# EAGLE design freesoc_mini_1.0 (EAGLE 6.3)
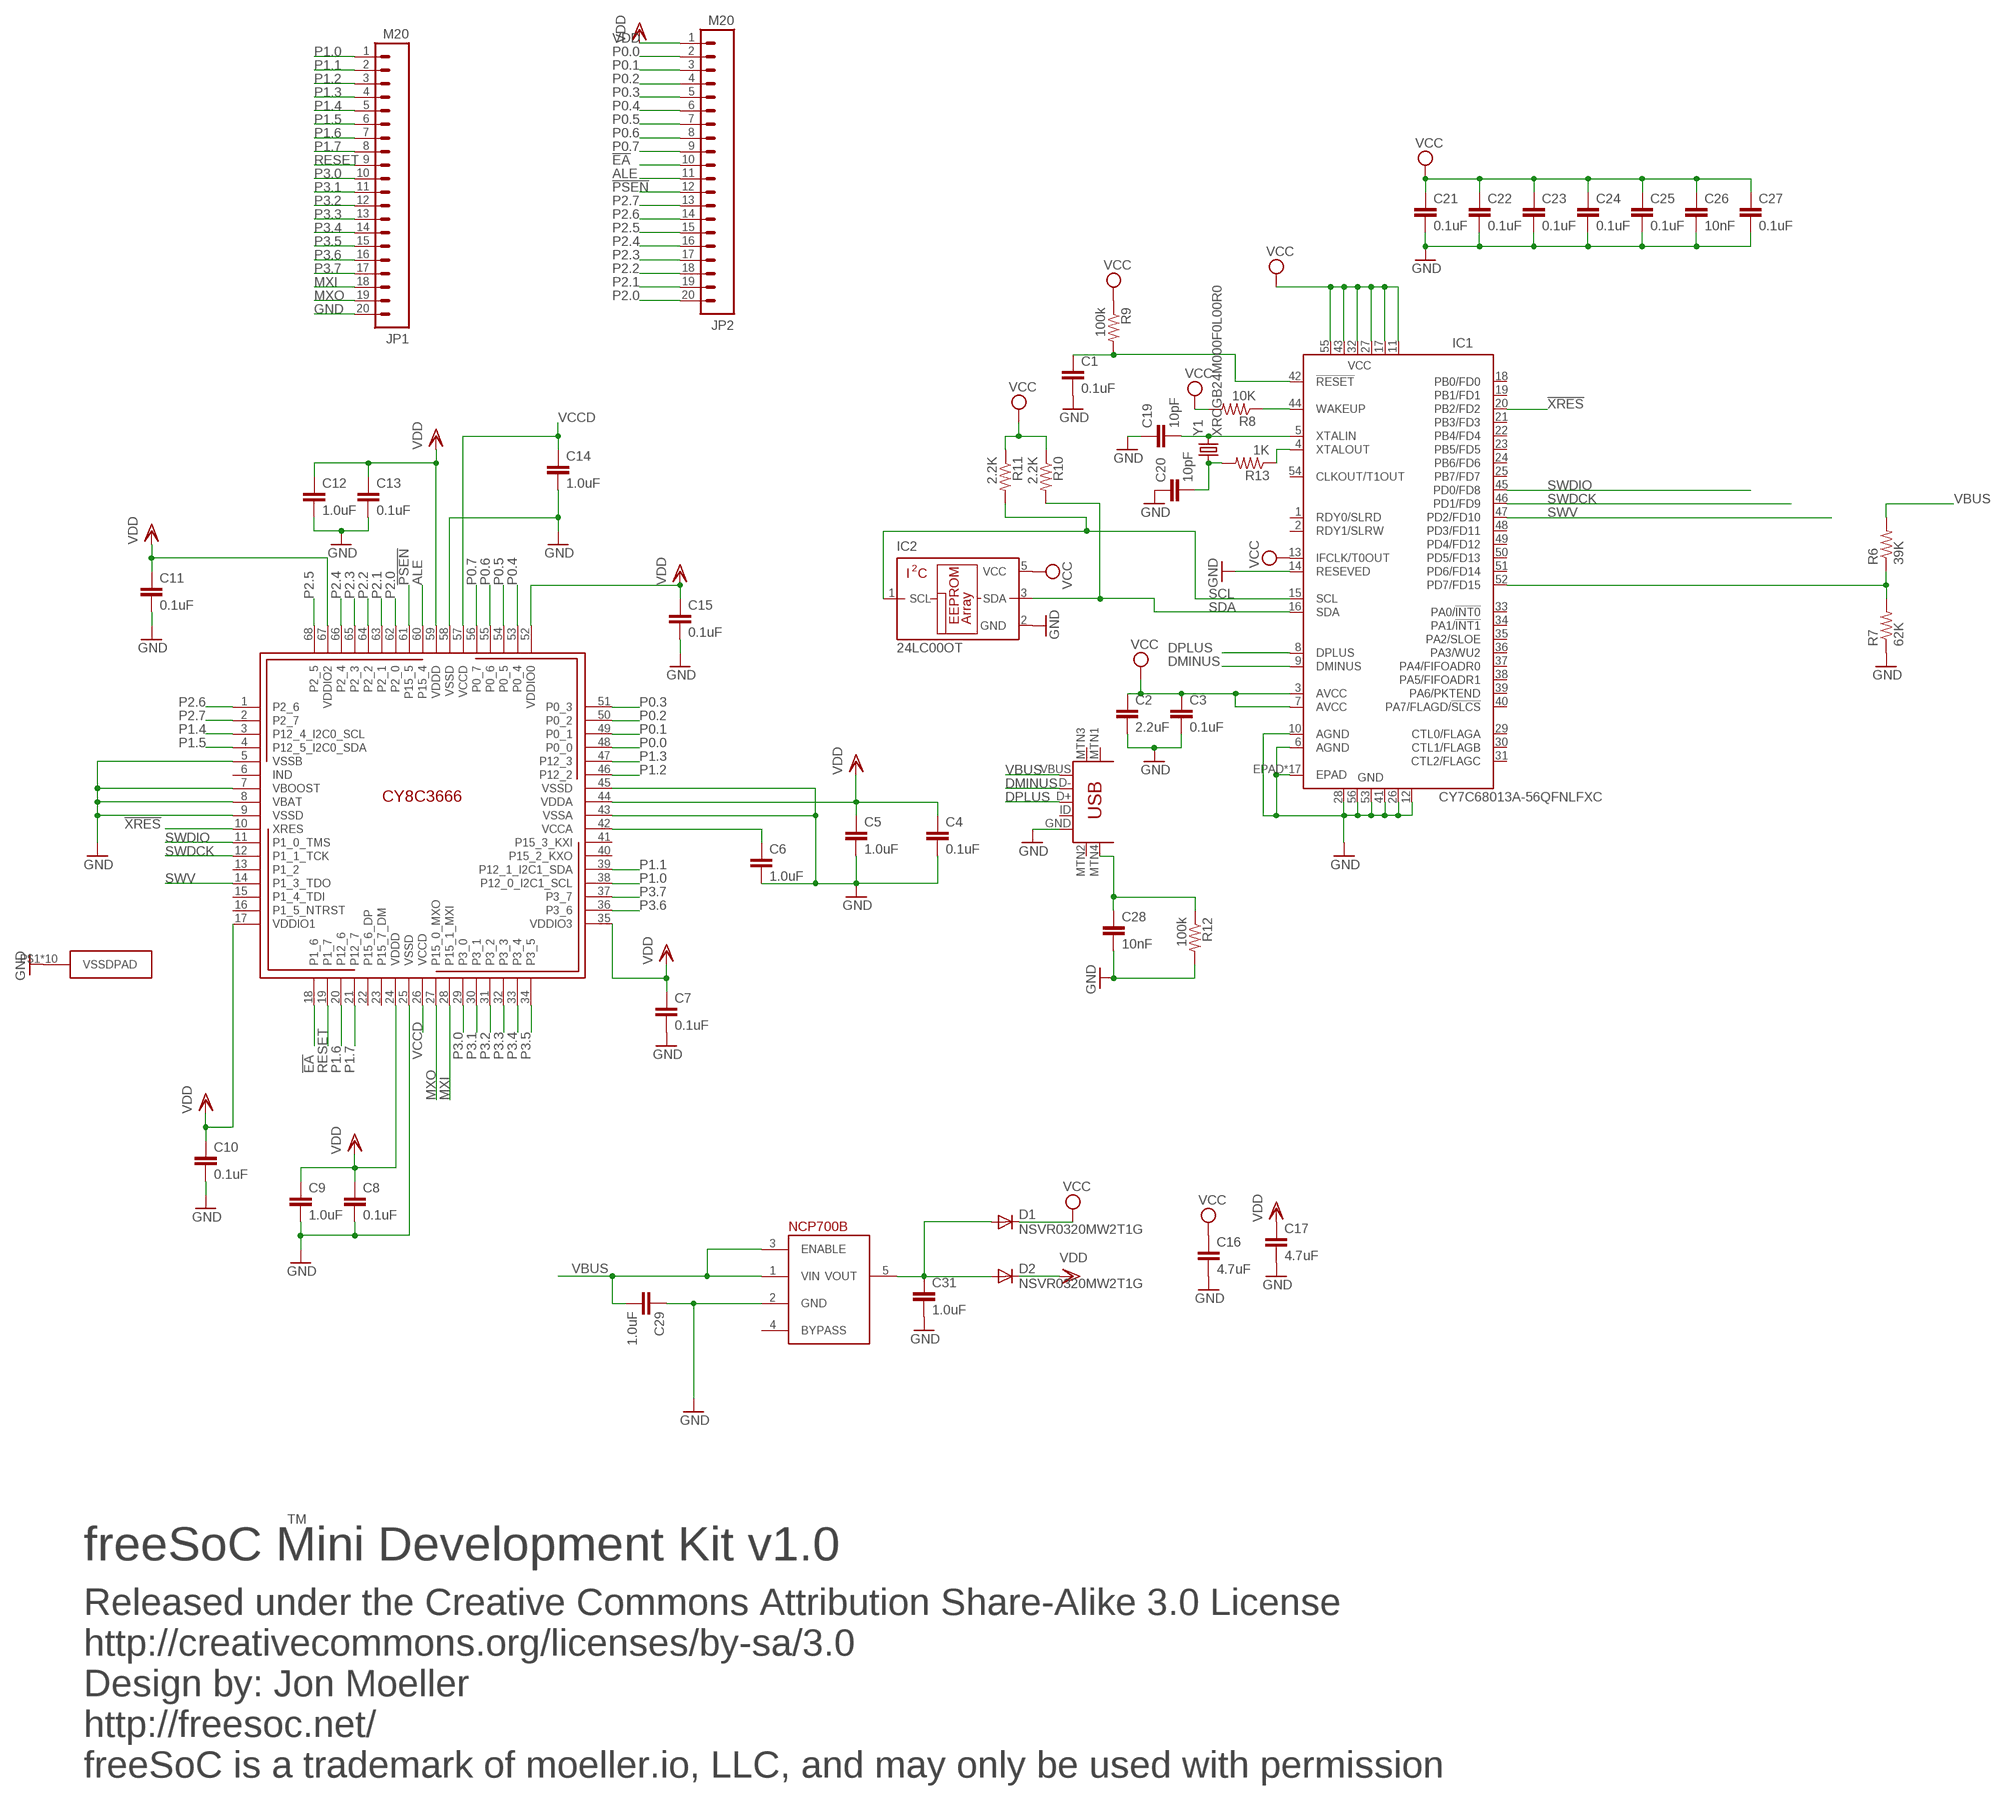
[diagram p0: schematic, sheet 1]

## Parts
C1  0.1uF  CAP0402-CAP  [0402-CAP]
C2  2.2uF  CAP0402-CAP  [0402-CAP]
C3  0.1uF  CAP0402-CAP  [0402-CAP]
C4  0.1uF  CAP0402-CAP  [0402-CAP]
C5  1.0uF  CAP0402-CAP  [0402-CAP]
C6  1.0uF  CAP0402-CAP  [0402-CAP]
C7  0.1uF  CAP0402-CAP  [0402-CAP]
C8  0.1uF  CAP0402-CAP  [0402-CAP]
C9  1.0uF  CAP0402-CAP  [0402-CAP]
C10  0.1uF  CAP0402-CAP  [0402-CAP]
C11  0.1uF  CAP0402-CAP  [0402-CAP]
C12  1.0uF  CAP0402-CAP  [0402-CAP]
C13  0.1uF  CAP0402-CAP  [0402-CAP]
C14  1.0uF  CAP0402-CAP  [0402-CAP]
C15  0.1uF  CAP0402-CAP  [0402-CAP]
C16  4.7uF  CAP0603-CAP  [0603-CAP]
C17  4.7uF  CAP0603-CAP  [0603-CAP]
C19  10pF  CAP0402-CAP  [0402-CAP]
C20  10pF  CAP0402-CAP  [0402-CAP]
C21  0.1uF  CAP0402-CAP  [0402-CAP]
C22  0.1uF  CAP0402-CAP  [0402-CAP]
C23  0.1uF  CAP0402-CAP  [0402-CAP]
C24  0.1uF  CAP0402-CAP  [0402-CAP]
C25  0.1uF  CAP0402-CAP  [0402-CAP]
C26  10nF  CAP0402-CAP  [0402-CAP]
C27  0.1uF  CAP0402-CAP  [0402-CAP]
C28  10nF  CAP0402-CAP  [0402-CAP]
C29  1.0uF  CAP0402-CAP  [0402-CAP]
C31  1.0uF  CAP0402-CAP  [0402-CAP]
D1  NSVR0320MW2T1G  DIODESOD  [SOD-323]
D2  NSVR0320MW2T1G  DIODESOD  [SOD-323]
IC1  CY7C68013A-56QFNLFXC  [QFN56]
IC2  24LC00OT  [SOT23-5L]
JP1  M20  [1X20]
JP2  M20  [1X20]
R6  39K  RESISTOR0402-RES  [0402-RES]
R7  62K  RESISTOR0402-RES  [0402-RES]
R8  10K  RESISTOR0402-RES  [0402-RES]
R9  100k  RESISTOR0402-RES  [0402-RES]
R10  2.2K  RESISTOR0402-RES  [0402-RES]
R11  2.2K  RESISTOR0402-RES  [0402-RES]
R12  100k  RESISTOR0402-RES  [0402-RES]
R13  1K  RESISTOR0402-RES  [0402-RES]
U$1  CY8C3X66LTI  [QFN-68]
U$3  FAN2558S36X  NCP700B  [TSOP-5]
USB-MINIB  USB-MINIB-5PIN  [USB-MINIB]
Y1  XRCGB24M000F0L00R0  CRYSTALXRCGB  [CRYSTAL_RESONATOR]

## Nets
!EA: JP2.10 U$1.18(P1_6)
!PSEN: JP2.12 U$1.61(P15_5)
!XRES: IC1.20(PB2/FD2) U$1.10(XRES)
ALE: JP2.11 U$1.60(P15_4)
DMINUS: IC1.9(DMINUS) USB-MINIB.D-
DPLUS: IC1.8(DPLUS) USB-MINIB.D+
GND: C1.2 C2.2 C3.2 C4.2 C5.2 C6.2 C7.2 C8.2 C9.2 C10.2 C11.2 C12.2 C13.2 C14.2 C15.2 C16.2 C17.2 C19.1 C20.1 C21.2 C22.2 C23.2 C24.2 C25.2 C26.2 C27.2 C28.2 C29.1 C31.2 IC1.6(AGND) IC1.10(AGND) IC1.12(GND) IC1.14(RESEVED) IC1.26(GND) IC1.28(GND) IC1.41(GND) IC1.53(GND) IC1.56(GND) IC1.EPAD IC1.P$1(EPAD) IC1.P$2(EPAD) IC1.P$3(EPAD) IC1.P$4(EPAD) IC1.P$5(EPAD) IC1.P$6(EPAD) IC1.P$7(EPAD) IC1.P$8(EPAD) IC1.P$9(EPAD) IC1.P$10(EPAD) IC1.P$11(EPAD) IC1.P$12(EPAD) IC1.P$13(EPAD) IC1.P$14(EPAD) IC1.P$15(EPAD) IC1.P$16(EPAD) IC2.2(GND) JP1.20 R7.1 R12.2 U$1.5(VSSB) U$1.7(VBOOST) U$1.8(VBAT) U$1.9(VSSD) U$1.25(VSSD) U$1.43(VSSA) U$1.45(VSSD) U$1.58(VSSD) U$1.P$1(VSSDPAD) U$1.P$2(VSSDPAD) U$1.P$3(VSSDPAD) U$1.P$4(VSSDPAD) U$1.P$5(VSSDPAD) U$1.P$6(VSSDPAD) U$1.P$7(VSSDPAD) U$1.P$8(VSSDPAD) U$1.P$9(VSSDPAD) U$1.PAD(VSSDPAD) U$3.2(GND) USB-MINIB.GND
MXI: JP1.18 U$1.28(P15_1_MXI)
MXO: JP1.19 U$1.27(P15_0_MXO)
N$1: IC1.52(PD7/FD15) R6.1 R7.2
N$2: IC1.44(WAKEUP) R8.1
N$3: C1.1 IC1.42(!RESET) R9.2
N$4: C28.1 R12.1 USB-MINIB.MTN4
N$5: IC1.4(XTALOUT) R13.1
N$7: C20.2 R13.2 Y1.P$1
N$8: C19.2 IC1.5(XTALIN) Y1.P$4
N$13: C6.1 U$1.42(VCCA)
P0.0: JP2.2 U$1.48(P0_0)
P0.1: JP2.3 U$1.49(P0_1)
P0.2: JP2.4 U$1.50(P0_2)
P0.3: JP2.5 U$1.51(P0_3)
P0.4: JP2.6 U$1.53(P0_4)
P0.5: JP2.7 U$1.54(P0_5)
P0.6: JP2.8 U$1.55(P0_6)
P0.7: JP2.9 U$1.56(P0_7)
P1.0: JP1.1 U$1.38(P12_0_I2C1_SCL)
P1.1: JP1.2 U$1.39(P12_1_I2C1_SDA)
P1.2: JP1.3 U$1.46(P12_2)
P1.3: JP1.4 U$1.47(P12_3)
P1.4: JP1.5 U$1.3(P12_4_I2C0_SCL)
P1.5: JP1.6 U$1.4(P12_5_I2C0_SDA)
P1.6: JP1.7 U$1.20(P12_6)
P1.7: JP1.8 U$1.21(P12_7)
P2.0: JP2.20 U$1.62(P2_0)
P2.1: JP2.19 U$1.63(P2_1)
P2.2: JP2.18 U$1.64(P2_2)
P2.3: JP2.17 U$1.65(P2_3)
P2.4: JP2.16 U$1.66(P2_4)
P2.5: JP2.15 U$1.68(P2_5)
P2.6: JP2.14 U$1.1(P2_6)
P2.7: JP2.13 U$1.2(P2_7)
P3.0: JP1.10 U$1.29(P3_0)
P3.1: JP1.11 U$1.30(P3_1)
P3.2: JP1.12 U$1.31(P3_2)
P3.3: JP1.13 U$1.32(P3_3)
P3.4: JP1.14 U$1.33(P3_4)
P3.5: JP1.15 U$1.34(P3_5)
P3.6: JP1.16 U$1.36(P3_6)
P3.7: JP1.17 U$1.37(P3_7)
RESET: JP1.9 U$1.19(P1_7)
SCL: IC1.15(SCL) IC2.1(SCL) R11.2
SDA: IC1.16(SDA) IC2.3(SDA) R10.2
SWDCK: IC1.46(PD1/FD9) U$1.12(P1_1_TCK)
SWDIO: IC1.45(PD0/FD8) U$1.11(P1_0_TMS)
SWV: IC1.47(PD2/FD10) U$1.14(P1_3_TDO)
VBUS: C29.2 R6.2 U$3.1(VIN) U$3.3(ENABLE) USB-MINIB.VBUS
VCC: C2.1 C3.1 C16.1 C21.1 C22.1 C23.1 C24.1 C25.1 C26.1 C27.1 D1.1(C) IC1.3(AVCC) IC1.7(AVCC) IC1.11(VCC) IC1.13(IFCLK/T0OUT) IC1.17(VCC) IC1.27(VCC) IC1.32(VCC) IC1.43(VCC) IC1.55(VCC) IC2.5(VCC) R8.2 R9.1 R10.1 R11.1
VCCD: C14.1 U$1.26(VCCD) U$1.57(VCCD)
VDD: C4.1 C5.1 C7.1 C8.1 C9.1 C10.1 C11.1 C12.1 C13.1 C15.1 C17.1 D2.1(C) JP2.1 U$1.17(VDDIO1) U$1.24(VDDD) U$1.35(VDDIO3) U$1.44(VDDA) U$1.52(VDDIO0) U$1.59(VDDD) U$1.67(VDDIO2)
VOUT: C31.1 D1.2(A) D2.2(A) U$3.5(VOUT)
Unconnected: IC1.1(RDY0/SLRD) IC1.2(RDY1/SLRW) IC1.18(PB0/FD0) IC1.19(PB1/FD1) IC1.21(PB3/FD3) IC1.22(PB4/FD4) IC1.23(PB5/FD5) IC1.24(PB6/FD6) IC1.25(PB7/FD7) IC1.29(CTL0/FLAGA) IC1.30(CTL1/FLAGB) IC1.31(CTL2/FLAGC) IC1.33(PA0/!INT0) IC1.34(PA1/!INT1) IC1.35(PA2/SLOE) IC1.36(PA3/WU2) IC1.37(PA4/FIFOADR0) IC1.38(PA5/FIFOADR1) IC1.39(PA6/PKTEND) IC1.40(PA7/FLAGD/!SLCS) IC1.48(PD3/FD11) IC1.49(PD4/FD12) IC1.50(PD5/FD13) IC1.51(PD6/FD14) IC1.54(CLKOUT/T1OUT) U$1.6(IND) U$1.13(P1_2) U$1.15(P1_4_TDI) U$1.16(P1_5_NTRST) U$1.22(P15_6_DP) U$1.23(P15_7_DM) U$1.40(P15_2_KXO) U$1.41(P15_3_KXI) U$3.4(BYPASS) USB-MINIB.ID USB-MINIB.MTN1(MTN2) USB-MINIB.MTN2(MTN3) USB-MINIB.MTN3(MTN1)

## Notes on the sheet
- TM
- freeSoC Mini Development Kit v1.0
- Released under the Creative Commons Attribution Share-Alike 3.0 License
- http://creativecommons.org/licenses/by-sa/3.0
- Design by: Jon Moeller
- http://freesoc.net/
- freeSoC is a trademark of moeller.io, LLC, and may only be used with permission

## Library data of the parts
C1 C3 C4 C7 C8 C10 C11 C13 C15 C21-C25 C27 = SparkFun:CAP: Capacitor Standard 0603 ceramic capacitor, and 0.1" leaded capacitor.; PN: LMK105BJ104KV-F
C2 = SparkFun:CAP: Capacitor Standard 0603 ceramic capacitor, and 0.1" leaded capacitor.; PN: JMK105BJ225MV-F
C5 C6 C9 C12 C14 C29 C31 = SparkFun:CAP: Capacitor Standard 0603 ceramic capacitor, and 0.1" leaded capacitor.; PN: JMK105BJ105KV-F
C16 C17 = SparkFun:CAP: Capacitor Standard 0603 ceramic capacitor, and 0.1" leaded capacitor.; PN: CC0603KRX5R6BB475
C19 C20 = SparkFun:CAP: Capacitor Standard 0603 ceramic capacitor, and 0.1" leaded capacitor.; PN: GJM1555C1H100FB01D
C26 C28 = SparkFun:CAP: Capacitor Standard 0603 ceramic capacitor, and 0.1" leaded capacitor.; PN: TMK105B7103KV-F
D1 D2 = SparkFun:DIODE: Diode These are standard reverse protection diodes and small signal diodes. SMA package can handle up to about 1A. SOD-323 can handle about 200mA. What the SOD-323 package when ordering, there are some mfgs out there that are 5-pin packages.; PN: NSVR0320MW2T1G
IC1 = cypress:CY7C6801*A-56QFN: EZ-USB FX2LP (TM) USB Microcontroller Source: http://www.cypress.com .. cy7c68013a_5.pdf; PN: CY7C68013A-56LTXC
IC2 = microchip:24*00: Serial EEPROM 128 bit, I2C (AA = 1.8 V/LC = 2.5 V/C = 5.0 V); PN: 24LC00T
JP1 JP2 = SparkFun:M20
R6 R7 = SparkFun:RESISTOR: Resistor Basic schematic elements and footprints for 0603, 1206, and PTH resistors.
R8 = SparkFun:RESISTOR: Resistor Basic schematic elements and footprints for 0603, 1206, and PTH resistors.; PN: ERJ-2GEJ103X
R9 R12 = SparkFun:RESISTOR: Resistor Basic schematic elements and footprints for 0603, 1206, and PTH resistors.; PN: RR0510P-104-D
R10 R11 = SparkFun:RESISTOR: Resistor Basic schematic elements and footprints for 0603, 1206, and PTH resistors.; PN: ERJ-2RKF2201X
R13 = SparkFun:RESISTOR: Resistor Basic schematic elements and footprints for 0603, 1206, and PTH resistors.; PN: ERJ-2RKF1001X
U$1 = PSoC3:CY8C3X66LTI; PN: CY8C5568LTI-114
U$3 = linear:NCP700B; PN: FAN2558S36X
USB-MINIB = SparkFun:USB-MINIB: Mini-USB "B" connector with 5th pin broken out. Created new symbol breaking out 5th "ID" pin in mini/micro USB connector spec. See: http://en.wikipedia.org/wiki/Mini_usb#Cables. Uses same footprint as 4-pin symbol. Also added pins to connect to mounting / shield pads if required (probably not generally needed as signals aren't shielded once they leave the connector).; PN: 10033526-N3212LF
Y1 = SparkFun:CRYSTAL: Crystals Various standard crystals. Proven footprints. Spark Fun Electronics SKU : COM-00534; PN: XRCGB24M000F0L00R0

## Board
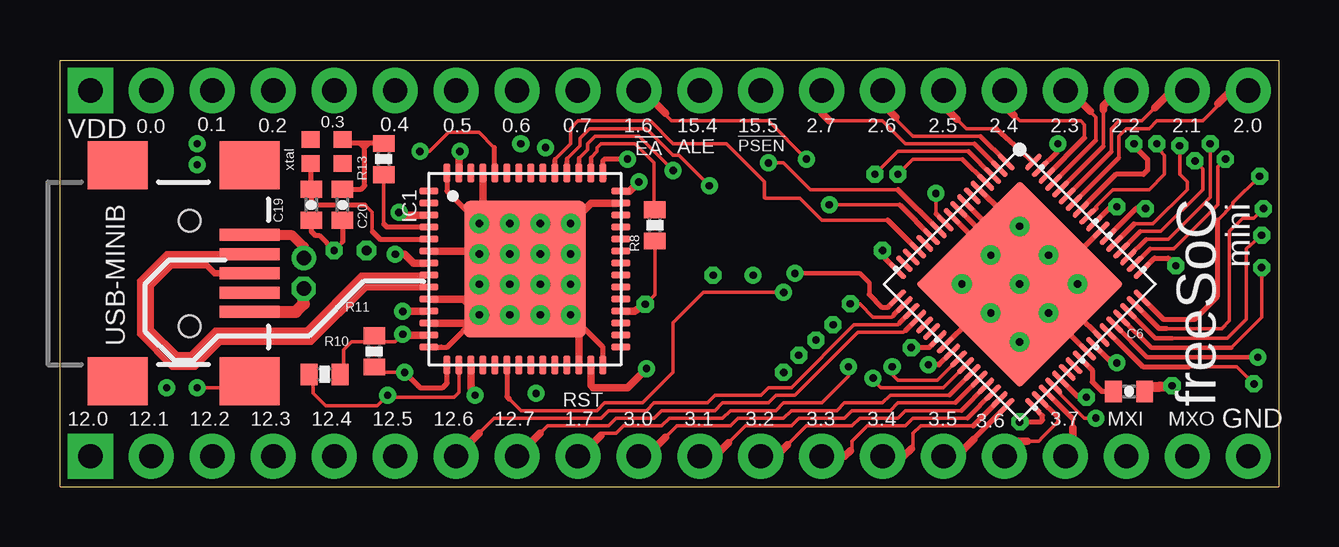
[diagram p1: board, top side]
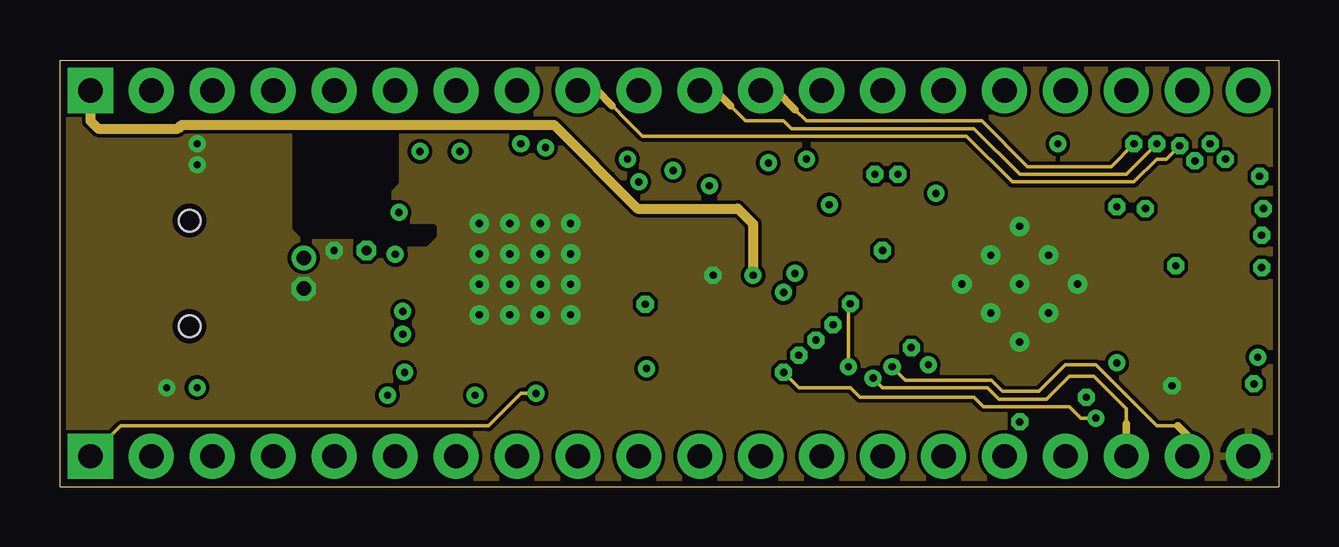
[diagram p2: board, inner layer Route2]
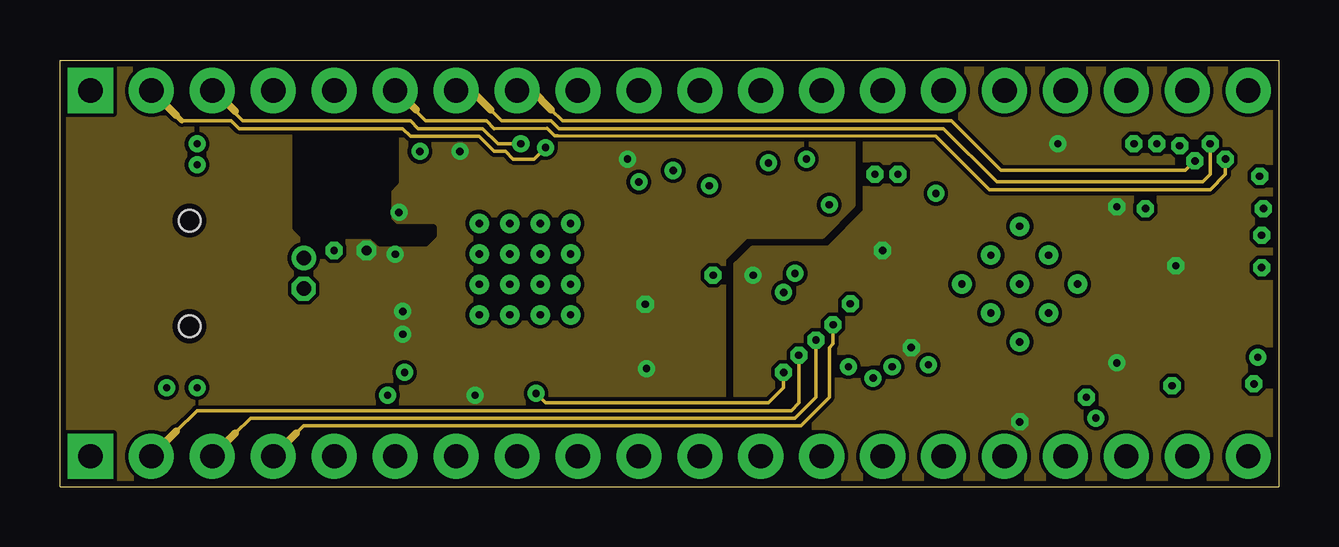
[diagram p3: board, inner layer Route15]
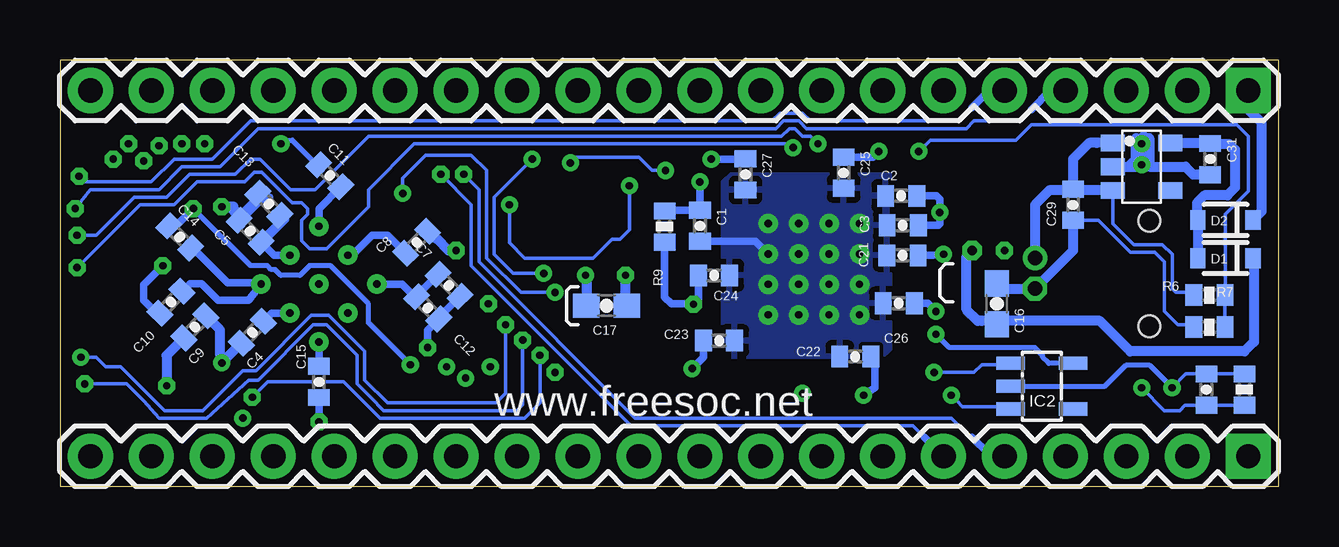
[diagram p4: board, bottom side, seen from below]

Size 50.8 x 17.78 mm. Coordinates in mm from the lower left corner, seen from the top.
Outline: 0,0 50.8,0 50.8,17.78 0,17.78 0,0
Copper layers (1*2+15*16): Top 0.035mm / dielectric 0.21mm / Route2 0.035mm / dielectric 1.04mm / Route15 0.035mm / dielectric 0.21mm / Bottom 0.035mm
Design rules "default": minimum track width 6mil, minimum drill 12mil, track to track 6mil, track to pad 6mil, pad to pad 6mil, via to via 6mil, smd to smd 0mil, copper to edge 10mil, drill to drill 20mil, minimum pad ring 10mil, minimum via ring 8mil, stop-mask expansion 4mil, vias tented up to drill 12mil, thermal gap 10mil

### Footprints (pad centres in the part's own frame; a part is rotated, then mirrored left to right if it is on the bottom)
0402-CAP = smd 0.7 x 0.9: 1 -0.65,0; 2 0.65,0
0603-CAP = smd 1.1 x 1: 1 -0.85,0; 2 0.85,0
SOD-323 = smd 0.63 x 0.83: 1 -1.15,0; 2 1.15,0
QFN56 = smd 0.8 x 0.3: 1 -4,3.25; 2 -4,2.75; 3 -4,2.25; 4 -4,1.75; 5 -4,1.25; 6 -4,0.75; 7 -4,0.25; 8 -4,-0.25; 9 -4,-0.75; 10 -4,-1.25; 11 -4,-1.75; 12 -4,-2.25; 13 -4,-2.75; 14 -4,-3.25; 29 4,-3.25; 30 4,-2.75; 31 4,-2.25; 32 4,-1.75; 33 4,-1.25; 34 4,-0.75; 35 4,-0.25; 36 4,0.25; 37 4,0.75; 38 4,1.25; 39 4,1.75; 40 4,2.25; 41 4,2.75; 42 4,3.25 | smd 0.3 x 0.8: 15 -3.25,-4; 16 -2.75,-4; 17 -2.25,-4; 18 -1.75,-4; 19 -1.25,-4; 20 -0.75,-4; 21 -0.25,-4; 22 0.25,-4; 23 0.75,-4; 24 1.25,-4; 25 1.75,-4; 26 2.25,-4; 27 2.75,-4; 28 3.25,-4; 43 3.25,4; 44 2.75,4; 45 2.25,4; 46 1.75,4; 47 1.25,4; 48 0.75,4; 49 0.25,4; 50 -0.25,4; 51 -0.75,4; 52 -1.25,4; 53 -1.75,4; 54 -2.25,4; 55 -2.75,4; 56 -3.25,4 | smd 5.1 x 5.7: EPAD 0,0 | drill 0.305: P$1 0.635,-0.635; P$2 0.635,0.635; P$3 1.905,0.635; P$4 1.905,1.905; P$5 0.635,1.905; P$6 -0.635,1.905; P$7 -1.905,1.905; P$8 -1.905,0.635; P$9 -0.635,0.635; P$10 -0.635,-0.635; P$11 -1.905,-0.635; P$12 -1.905,-1.905; P$13 -0.635,-1.905; P$14 0.635,-1.905; P$15 1.905,-1.905; P$16 1.905,-0.635
SOT23-5L = smd 0.55 x 1.2: 1 -0.95,-1.3; 2 0,-1.3; 3 0.95,-1.3; 4 0.95,1.3; 5 -0.95,1.3
1X20 = drill 1.016 pad 1.88 square: 1 0,0 | drill 1.016 pad 1.88: 2 2.54,0; 3 5.08,0; 4 7.62,0; 5 10.16,0; 6 12.7,0; 7 15.24,0; 8 17.78,0; 9 20.32,0; 10 22.86,0; 11 25.4,0; 12 27.94,0; 13 30.48,0; 14 33.02,0; 15 35.56,0; 16 38.1,0; 17 40.64,0; 18 43.18,0; 19 45.72,0; 20 48.26,0
0402-RES = smd 0.7 x 0.9: 1 -0.65,0; 2 0.65,0
QFN-68 = smd 0.9 x 0.2: 1 -4,3.2; 2 -4,2.8; 3 -4,2.4; 4 -4,2; 5 -4,1.6; 6 -4,1.2; 7 -4,0.8; 8 -4,0.4; 9 -4,0; 10 -4,-0.4; 11 -4,-0.8; 12 -4,-1.2; 13 -4,-1.6; 14 -4,-2; 15 -4,-2.4; 16 -4,-2.8; 17 -4,-3.2; 35 4,-3.2; 36 4,-2.8; 37 4,-2.4; 38 4,-2; 39 4,-1.6; 40 4,-1.2; 41 4,-0.8; 42 4,-0.4; 43 4,0; 44 4,0.4; 45 4,0.8; 46 4,1.2; 47 4,1.6; 48 4,2; 49 4,2.4; 50 4,2.8; 51 4,3.2 | smd 0.2 x 0.9: 18 -3.2,-4; 19 -2.8,-4; 20 -2.4,-4; 21 -2,-4; 22 -1.6,-4; 23 -1.2,-4; 24 -0.8,-4; 25 -0.4,-4; 26 0,-4; 27 0.4,-4; 28 0.8,-4; 29 1.2,-4; 30 1.6,-4; 31 2,-4; 32 2.4,-4; 33 2.8,-4; 34 3.2,-4; 52 3.2,4; 53 2.8,4; 54 2.4,4; 55 2,4; 56 1.6,4; 57 1.2,4; 58 0.8,4; 59 0.4,4; 60 0,4; 61 -0.4,4; 62 -0.8,4; 63 -1.2,4; 64 -1.6,4; 65 -2,4; 66 -2.4,4; 67 -2.8,4; 68 -3.2,4 | drill 0.305: P$1 -1.705,-1.705; P$2 0,-1.705; P$3 1.705,-1.705; P$4 1.705,0; P$5 0,0; P$6 -1.705,0; P$7 -1.705,1.705; P$8 0,1.705; P$9 1.705,1.705 | smd 6.1 x 6.1: PAD 0,0
TSOP-5 = smd 0.7 x 1: 1 -0.99,-1.2; 2 0,-1.2; 3 0.99,-1.2; 4 0.99,1.2; 5 -0.99,1.2
USB-MINIB = smd 2.5 x 0.5: D+ 2.5,0; D- 2.5,0.8; GND 2.5,-1.6; ID 2.5,-0.8; VBUS 2.5,1.6 | smd 2.5 x 2: MTN1 -3,4.5; MTN2 2.5,4.5; MTN3 -3,-4.5; MTN4 2.5,-4.5 | hole 0.9: 0,2.2; 0,-2.2
CRYSTAL_RESONATOR = smd 0.75 x 0.7: P$1 -0.675,-0.5; P$2 -0.675,0.5; P$3 0.675,-0.5; P$4 0.675,0.5

### Placement (x,y rotation side)
C1  24.12,10.87 270 bottom
C2  15.73,12.12 180 bottom
C3  15.67,10.89 180 bottom
C4  42.78,6.43 45 bottom
C5  42.87,10.65 315 bottom
C6  44.56,3.97 0 top
C7  34.59,8.39 135 bottom
C8  35.93,10.18 225 bottom
C9  45.17,6.66 225 bottom
C10  46.17,7.69 45 bottom
C11  39.55,12.96 315 bottom
C12  35.47,7.45 135 bottom
C13  42.09,11.77 315 bottom
C14  45.81,10.41 315 bottom
C15  40,4.37 90 bottom
C16  11.75,7.62 90 bottom
C17  28.02,7.54 0 bottom
C19  10.48,11.75 90 top
C20  11.77,11.75 90 top
C21  15.68,9.64 180 bottom
C22  17.65,5.42 180 bottom
C23  23.33,6.09 0 bottom
C24  23.54,8.81 0 bottom
C25  18.13,13.08 270 bottom
C26  15.84,7.64 180 bottom
C27  22.23,13.02 270 bottom
C28  3.02,4.05 90 bottom
C29  8.57,11.75 90 bottom
C31  2.86,13.65 270 bottom
D1  2.22,9.53 180 bottom
D2  2.22,11.11 180 bottom
IC1  19.38,9.07 0 top
IC2  9.87,4.19 270 bottom
JP1  1.27,1.27 180 bottom
JP2  1.27,16.51 180 bottom
R6  2.89,7.99 180 bottom
R7  2.89,6.65 0 bottom
R8  24.8,10.89 270 top
R9  25.6,10.84 90 bottom
R10  11.03,4.68 180 top
R11  13.1,5.64 270 top
R12  1.43,4.05 90 bottom
R13  13.49,13.65 90 top
U$1  40.01,8.44 315 top
U$3  5.71,13.34 270 bottom
USB-MINIB  5.4,8.89 0 top
Y1  11.11,13.97 180 top

### Tracks (layer width: path | path; a pad name or v marks a point on that pad's centre or on a via)
!EA  (via drill 0.3)
  Top 0.152: U$1.18 34.98,7.94 | v31.11,13.65 29.53,15.24 25.48,15.24 24.53,16.19 JP2.10
  Top 0.178: 33.73,8.02 33.73,8.49 33.34,8.89 v30.64,8.89
  Top 0.203: U$1.18 34.5,7.46 34.29,7.46 33.73,8.02
  Top 0.305: 24.53,16.19 24.61,16.19 25.24,15.56
  Bottom 0.152: v30.64,8.89 31.91,8.89 32.7,9.68 32.7,12.06 v31.11,13.65
!PSEN  (via drill 0.3)
  Top 0.203: 44.77,14.32 v44.77,14.29 44.77,14.21 45.32,13.65 45.32,13.18 45.16,13.02 44.02,13.02 U$1.61
  Route2 0.152: 30.64,15.72 31.11,15.24 38.42,15.24 40.32,13.34 43.81,13.34 v44.77,14.29 | JP2.12 29.84,16.51
  Route2 0.305: 29.84,16.51 30.64,15.72
!XRES  (via drill 0.3)
  Top 0.152: 18.73,3.65 19.21,3.17 22.38,3.17 22.7,3.49 24.29,3.49 25.56,4.76 25.56,6.83 26.83,8.1 v30.16,8.1 | v30.16,8.1 | v36.51,12.22 36.51,11.37
  Top 0.203: IC1.20 18.63,3.75 18.73,3.65 | 36.51,11.37 U$1.10
  Bottom 0.152: v30.16,8.1 31.59,8.1 33.02,9.53 33.02,13.18 33.66,13.81 35.56,13.81 36.51,12.86 v36.51,12.22
ALE  (via drill 0.3)
  Top 0.152: v45.72,14.29 45.72,14.16 46.04,13.81 46.04,13.02 45.4,12.38 43.89,12.38 43.18,11.67 43.18,11.59 | 42.79,11.2 U$1.60
  Top 0.203: 43.18,11.59 42.79,11.2
  Route2 0.152: v45.72,14.29 44.45,13.02 40.01,13.02 38.1,14.92 30.48,14.92 30.16,15.24 28.57,15.24 27.94,15.88 | JP2.11 27.23,16.51
  Route2 0.305: 27.23,16.51 27.3,16.51 27.94,15.88
DMINUS
  Top 0.279: IC1.9 12.76,8.32 10.48,6.03 6.67,6.03 5.64,5 4.68,5 3.33,6.35 3.33,8.57 4.45,9.68 8.22,9.68 | 8.26,9.68 8.22,9.68 | 8.22,9.68 USB-MINIB.D-
DPLUS
  Top 0.279: IC1.8 15.23,8.82 15.2,8.79 12.56,8.79 10.27,6.5 6.48,6.5 5.45,5.47 4.89,5.47 3.79,6.57 3.79,8.36 4.65,9.22 6.12,9.22 6.45,8.89 USB-MINIB.D+
  Top 0.406: 8.22,8.89 USB-MINIB.D+
GND  (via drill 0.3, 0.6)
  Top 0.152: 37.98,6.99 38.1,6.99 39.56,8.44 U$1.P$5 | U$1.5 40.01,10.7 U$1.P$5 | U$1.P$5 40.01,9.57 | U$1.P$5 40.01,9.01 | 11.78,10.19 v11.43,9.84
  Top 0.203: U$1.25 37.98,6.99 | 40.01,9.57 U$1.7 | 40.01,9.01 U$1.8 | U$1.P$5 U$1.9 | C19.1 10.48,10.64 10.64,10.48 10.79,10.48 v11.43,9.84 | C20.1 11.78,10.19 | C6.2 45.09,4.17 | 15.9,5.82 IC1.14 16.13,5.82 IC1.P$12 | IC1.56 16.13,12.32 IC1.P$7 | IC1.28 22.63,5.82 IC1.P$15 | 40.32,5.24 40.01,5.56 U$1.P$3 | U$1.45 42.34,7.24 U$1.P$4 U$1.43 | U$1.58 42.34,9.65 U$1.P$8
  Top 0.254: U$1.5 39.28,11.43 39.93,11.51
  Top 0.305: IC1.6 17.36,9.82 IC1.P$8 | IC1.10 16.82,7.82 IC1.P$12 17.13,6.82 IC1.12 | IC1.26 21.63,6.82 IC1.P$15 | IC1.41 22.13,11.82 IC1.P$4 | IC1.53 17.63,11.13 IC1.P$7 | IC1.P$10 IC1.EPAD
  Top 0.406: 40.48,5.56 40.32,5.24 | 45.09,4.17 45.85,4.17 v46.35,4.21
  Top 0.508: USB-MINIB.GND 9.83,7.29 10.16,7.62 v10.16,8.26
  Bottom 0.152: C28.2 | 10.06,8.16 v10.16,8.26 | R12.2 C28.2 | C28.2 3.87,4.7 v4.45,4.13 | R7.1 3.63,6.75 4.21,6.75 4.76,7.3 4.76,9.37 5.16,9.76 6.19,9.76 7.53,11.1 C29.1
  Bottom 0.203: IC2.2 7.24,4.19 6.35,5.08 5.4,5.08 v4.45,4.13
  Bottom 0.305: C1.2 21.8,10.22 IC1.P$3 | C10.2 45.38,8.47 44.9,8.47 44.21,7.78 42.94,7.78 U$1.P$9 42.49,8.49 43.81,8.49 45.27,9.95 C14.2 | C8.2 37.15,10.48 37.78,10.48 38.68,9.58 U$1.P$6 | C12.2 35.93,7.97 C7.2 35.96,7.94 36.04,7.94 36.54,8.44 U$1.P$1 | U$1.P$3 40.01,6.17 C15.2 | C11.2 40.01,11.59 U$1.P$7 | C5.2 41.87,9.65 U$1.P$8 | C4.2 41.98,7.24 U$1.P$4
  Bottom 0.406: C5.2 41.45,11.15 C13.2 | C11.2 39.13,12.49 39.29,12.3 | C9.2 46.35,5.48 v46.35,4.21 | C29.1 8.57,9.84 v10.16,8.26 11.37,8.26 C16.2 | C17.2 27.23,7.52 v27.23,8.81 | 5.71,13.34 U$3.2 6.27,13.34 5.95,13.65 5.95,14.53 5.4,14.53 5.4,13.34 | 5.4,13.34 3.89,13.34 3.57,13.02 2.86,13.02 C31.2 | 5.4,13.34 5.71,13.34 | 5.71,13.34 v5.71,13.41 v5.71,14.29 5.71,14.53 5.64,14.61
  pour Bottom: 16.19,13.02 16.19,5.71 16.51,5.4 22.86,5.4 23.18,5.71 23.18,12.7 22.86,13.02
  pour Route2: 0,17.78 50.8,17.78 50.8,0 0,0
MXI  (via drill 0.3)
  Top 0.152: U$1.28 36.82,4.13 34.21,4.13 33.89,4.45 v33.89,4.52
  Route2 0.152: JP1.18 44.45,1.75 | 44.45,2.62 44.45,3.25 43.1,4.6 42.07,4.6 41.12,3.65 39.13,3.65 38.66,4.13 34.29,4.13 v33.89,4.52
  Route2 0.305: 44.45,1.75 44.45,2.62
MXO  (via drill 0.3)
  Top 0.152: U$1.27 36.58,4.45 34.92,4.45 34.69,4.68 v34.69,5
  Route2 0.152: 46.99,2.06 46.99,1.91 JP1.19 | 46.59,2.54 45.72,2.54 43.18,5.08 41.91,5.08 40.8,3.97 39.29,3.97 38.81,4.45 35.24,4.45 v34.69,5
  Route2 0.305: 46.99,1.91 46.99,2.14 46.59,2.54
N$1  (via drill 0.3)
  Top 0.152: v15,13.97 15.4,13.97 16.19,14.76 17.46,14.76 18.1,14.13 | 18.1,12.9 IC1.52
  Top 0.203: 18.1,14.13 18.1,12.9
  Bottom 0.152: 6.19,15.08 10.32,15.08 10.95,14.45 14.53,14.45 v15,13.97 | 6.19,15.08 1.75,15.08 1.27,14.61 1.27,12.3 2.22,11.35 2.22,7.94 2.24,7.95 R6.1 | 6.19,15.08 | R6.1 | R6.1 R7.2
N$2
  Top 0.152: 22.13,13.72 22.38,13.97 22.38,14.13 22.54,14.29 23.97,14.29 24.77,13.49 24.77,11.57 R8.1
  Top 0.178: 22.13,13.4 22.13,13.72
  Top 0.203: IC1.44 22.13,13.4
N$3  (via drill 0.3)
  Top 0.305: IC1.42 23.75,12.32 v24.13,12.7
  Bottom 0.305: v24.13,12.7 C1.1 25.57,11.52 R9.2
N$4  (via drill 0.3)
  Top 0.152: v5.71,4.13 7.62,4.13 7.9,4.41 | USB-MINIB.MTN4 7.9,4.41 | 7.9,4.41 7.94,4.45
  Bottom 0.152: C28.1 R12.1 3.9,3.4 4.13,3.17 4.76,3.17 v5.71,4.13 | C28.1
N$5
  Top 0.152: 13.49,10.95 R13.1
  Top 0.203: IC1.4 13.63,10.82 13.49,10.95
N$6
  cutout Route2: 9.84,14.92 9.84,10.79 10.16,10.48 13.02,10.48 13.34,10.16 15.24,10.16 15.56,10.48 15.56,10.79 13.97,10.79 13.65,11.11 13.65,12.38 13.97,12.7 13.97,14.92
  cutout Route15: 9.84,14.92 9.84,10.79 10.16,10.48 13.02,10.48 13.34,10.16 15.24,10.16 15.56,10.48 15.56,10.79 13.97,10.79 13.65,11.11 13.65,12.38 13.97,12.7 13.97,14.92
N$7
  Top 0.152: 11.96,14.3 Y1.P$1
  Top 0.203: R13.2 12.86,14.3 | 12.86,14.3 11.96,14.3 | C20.2 12.56,12.4 12.7,12.54 12.7,14.13 | 12.86,14.3 12.7,14.14 12.7,14.13 | 12.7,14.13 12.54,14.29
N$8
  Top 0.152: 10.44,12.36 C19.2 | 12.7,11.75 13.02,11.43 13.02,10.64 | 15.58,10.32 IC1.5
  Top 0.203: Y1.P$4 10.44,12.36 | C19.2 10.48,11.91 10.64,11.75 12.7,11.75 | 13.02,10.64 13.34,10.32 15.58,10.32
N$13
  Top 0.203: U$1.42 43.02,4.86 43.02,4.37 43.42,3.97 C6.1
P0.0  (via drill 0.3)
  Top 0.152: 48.82,5.79 50.09,7.06 v50.09,9.13
  Top 0.178: U$1.48 45.48,5.79 48.82,5.79
  Route15 0.152: v20.24,14.13 19.76,13.65 18.89,13.65 18.57,13.97 18.1,13.97 17.46,14.61 14.61,14.61 14.29,14.92 7.46,14.92 7.14,15.24 5.08,15.24
  Route15 0.203: JP2.2 3.97,16.35 | 4.84,15.48 5.08,15.24
  Route15 0.305: 3.97,16.35 4.84,15.48
  Bottom 0.152: v50.09,9.13 47.47,11.75 46.04,11.75 45.09,12.7 43.1,12.7 42.7,13.1 42.39,13.1 41.12,11.83 40.72,11.83 40.48,11.59 40.48,11.35 40.72,11.11 40.72,10.24 40.4,9.92 39.69,9.92 37.94,11.67 37.94,12.38 36.04,14.29 20.4,14.29 v20.24,14.13
P0.1  (via drill 0.3)
  Top 0.152: v50.09,10.48 49.45,9.92 49.45,6.99 48.66,6.19 46.35,6.19
  Top 0.178: U$1.49 45.65,6.19 46.35,6.19
  Route15 0.152: v19.21,14.29 18.26,14.29 17.62,14.92 14.92,14.92 14.61,15.24 7.62,15.24 6.67,16.19 JP2.3
  Route15 0.305: 6.67,16.19 6.75,16.19 7.3,15.64
  Bottom 0.152: v50.09,10.48 49.29,10.48 47.7,12.06 46.35,12.06 45.4,13.02 43.5,13.02 42.86,13.65 42.47,13.65 41.2,12.38 40.16,12.38 37.94,14.61 20.72,14.61 20.4,14.92 20.16,14.92 19.84,14.61 19.53,14.61 v19.21,14.29
P0.2  (via drill 0.3)
  Top 0.152: 46.12,6.59 48.42,6.59 48.74,6.91 48.74,10.64 49.29,11.19 49.77,11.19 v50.16,11.59
  Top 0.203: U$1.50 45.82,6.59 46.12,6.59
  Bottom 0.152: v50.16,11.59 49.53,12.38 46.67,12.38 45.72,13.34 44.13,13.34 42.55,14.92 20.95,14.92 20.64,15.24 20,15.24 19.68,14.92 13.02,14.92 12.7,15.24 10.79,15.24 10.32,15.72 | JP2.4 9.53,16.51
  Bottom 0.305: 9.53,16.51 10.32,15.72
P0.3  (via drill 0.3)
  Top 0.152: v50.01,12.94 48.9,11.83 48.9,11.75 48.26,11.11
  Top 0.203: U$1.51 45.99,6.99 47.31,6.99 48.26,7.94 48.26,11.11
  Bottom 0.152: v50.01,12.94 49.77,12.7 46.99,12.7 46.04,13.65 44.45,13.65 42.86,15.24 21.11,15.24 20.8,15.56 19.84,15.56 19.53,15.24 13.34,15.24 12.78,15.8 | JP2.5 12.06,16.51
  Bottom 0.305: 12.06,16.51 12.78,15.8
P0.4  (via drill 0.3)
  Top 0.152: 45.45,9.92 46.43,9.92 48.26,11.75 48.26,13.34 v48.58,13.65
  Top 0.178: 45.45,9.92 U$1.53
  Route15 0.152: v48.58,13.65 48.58,13.02 47.94,12.38 38.73,12.38 36.51,14.61 20.75,14.62 20.61,14.62 20.3,14.93 18.1,14.92 17.78,15.24 15.24,15.24 JP2.6
  Route15 0.305: JP2.6 14.05,16.51 14.84,15.72
P0.5  (via drill 0.3)
  Top 0.152: 45.28,10.32 46.2,10.32 47.94,12.06 v47.94,14.29
  Top 0.178: 45.28,10.32 U$1.54
  Route15 0.152: v47.94,14.29 47.94,13.02 47.62,12.7 39.05,12.7 36.83,14.92 20.8,14.92 20.48,15.24 18.41,15.24 17.94,15.72 | JP2.7 17.14,16.51
  Route15 0.305: 17.14,16.51 17.94,15.72
P0.6  (via drill 0.3)
  Top 0.152: 45.03,10.64 45.88,10.64 47.62,12.38 47.62,13.26 v47.31,13.57
  Top 0.178: 45.03,10.64 U$1.55
  Route15 0.152: v47.31,13.57 46.91,13.18 39.21,13.18 37.15,15.24 20.95,15.24 20.48,15.72 | JP2.8 19.68,16.51
  Route15 0.305: 19.68,16.51 20.48,15.72
P0.7  (via drill 0.3)
  Top 0.152: 44.78,10.95 45.56,10.95 46.99,12.38 46.99,12.7 46.67,13.02 v46.67,14.21
  Top 0.203: 44.78,10.95 U$1.56
  Route2 0.152: v46.67,14.21 46.12,13.65 45.72,13.65 44.77,12.7 39.69,12.7 37.78,14.61 24.29,14.61 22.38,16.51 JP2.9
  Route2 0.305: 22.38,16.51 23.02,15.88
P1.0  (via drill 0.3)
  Top 0.152: U$1.38 41.35,4.21 42.7,2.86 v43.18,2.86
  Route2 0.152: v43.18,2.86 42.55,2.86 42.07,3.33 38.5,3.33 38.1,3.73 33.34,3.73 32.94,4.13 30.8,4.13 v30.16,4.76 | v19.84,3.89 19.21,3.89 17.86,2.54 2.54,2.54 JP1.1
  Route15 0.152: v30.16,4.76 30.16,4.13 29.53,3.49 20.24,3.49 v19.84,3.89 | JP1.1 1.51,1.51
P1.1  (via drill 0.3)
  Top 0.152: v42.78,3.73 42.45,3.73
  Top 0.203: 42.45,3.73 U$1.39
  Route15 0.152: v30.8,5.48 30.8,3.49 30.48,3.17 5.71,3.17 4.84,2.3 | JP1.2 4.05,1.51
  Route15 0.305: 4.05,1.51 4.84,2.3
  Bottom 0.152: v30.8,5.48 30.8,3.49 31.43,2.86 37.47,2.86 38.97,4.37 42.15,4.37 42.7,3.81 v42.78,3.73
P1.2  (via drill 0.3)
  Top 0.152: 47.07,5 49.05,5 v49.77,4.29
  Top 0.203: U$1.46 45.14,5 47.07,5
  Route15 0.152: v31.51,6.11 31.51,3.73 30.64,2.86 7.94,2.86 7.3,2.22 | JP1.3 6.59,1.51
  Route15 0.305: 6.59,1.51 7.3,2.22
  Bottom 0.152: v31.51,6.11 31.51,3.41 31.75,3.17 37.31,3.17 37.86,3.73 38.42,4.29 38.42,5.48 39.69,6.75 40.24,6.75 42.55,4.45 42.94,4.45 44.69,2.86 46.67,2.86 47.31,3.57 48.02,4.29 v49.77,4.29
P1.3  (via drill 0.3)
  Top 0.178: U$1.47 45.31,5.4 v49.93,5.4
  Route15 0.152: v32.23,6.75 32.23,5.95 32.07,5.79 32.07,3.73 30.88,2.54 10.16,2.54 9.84,2.22 | JP1.4 9.21,1.59
  Route15 0.305: 9.21,1.59 9.84,2.22
  Bottom 0.152: v32.23,6.75 32.23,3.89 32.62,3.49 37.15,3.49 38.1,4.45 38.1,5.64 39.61,7.14 40.32,7.14 42.62,4.84 43.18,4.84 44.85,3.17 46.43,3.17 48.26,5 48.9,5 49.29,5.4 v49.93,5.4
P1.4  (via drill 0.3)
  Top 0.152: 37.87,13.97 34.92,13.97 v33.97,13.02
  Top 0.178: 37.87,13.97 U$1.3
  Bottom 0.152: v33.97,13.02 33.34,12.38 33.34,9.37 26.83,2.86 13.65,2.86 12.06,1.27 JP1.5
  Bottom 0.305: 12.06,1.27 12.06,1.35 12.78,2.06
P1.5  (via drill 0.3)
  Top 0.152: v34.92,13.02 35.56,13.65 37.62,13.65
  Top 0.178: 37.62,13.65 U$1.4
  Bottom 0.152: v34.92,13.02 33.66,11.75 33.66,9.21 26.99,2.54 15.24,2.54 14.76,2.06 | JP1.6 14.29,1.59
  Bottom 0.305: 14.29,1.59 14.76,2.06
P1.6
  Top 0.152: 35,6.83 35,6.82 34.92,6.75 33.1,6.75 30.48,4.13 29.53,4.13 29.21,3.81 27.3,3.81 26.99,3.49 24.77,3.49 24.45,3.17 22.86,3.17 22.54,2.86 18.1,2.86 17.46,2.22 | JP1.7 16.99,1.75
  Top 0.203: 35,6.83 U$1.20
  Top 0.305: 16.99,1.75 17.46,2.22
P1.7
  Top 0.152: 35.24,6.51 35.16,6.43 33.26,6.43 30.64,3.81 29.84,3.81 29.53,3.49 27.62,3.49 27.3,3.17 25.08,3.17 24.77,2.86 23.18,2.86 22.86,2.54 20.32,2.54 20,2.22 | JP1.8 19.45,1.67
  Top 0.203: 35.24,6.51 U$1.21
  Top 0.305: 19.45,1.67 20,2.22
P2.0
  Top 0.152: 44.13,13.7 44.13,14.61 44.45,14.92 45.4,14.92 45.72,15.24 47.62,15.24 48.9,16.51
  Top 0.178: U$1.62 44.13,13.7
  Top 0.305: 48.26,15.95 48.74,16.43 48.9,16.43 48.97,16.51 JP2.20 48.9,16.51
P2.1
  Top 0.152: 43.81,13.95 43.81,14.92 44.13,15.24 45.09,15.24 45.64,15.8 | 46.35,16.51 JP2.19
  Top 0.178: U$1.63 43.81,13.95
  Top 0.305: 45.64,15.8 46.35,16.51
P2.2
  Top 0.152: 43.5,14.2 43.5,15.72 | 44.13,16.51 JP2.18
  Top 0.178: U$1.64 43.5,14.2
  Top 0.305: 43.5,15.72 43.5,15.88 44.13,16.51
P2.3
  Top 0.152: 43.18,14.44 43.18,15.4 42.07,16.51 | 42.07,16.51 | 42.07,16.51 JP2.17
  Top 0.178: U$1.65 43.18,14.44
  Top 0.305: 42.07,16.51 42.94,15.64
P2.4
  Top 0.152: 42.7,14.53 42.7,15.08 42.55,15.24 40.01,15.24 39.77,15.48 | 39.37,15.88 JP2.16
  Top 0.203: U$1.66 42.7,14.53
  Top 0.305: 39.37,15.88 39.77,15.48
P2.5
  Top 0.152: 37.39,15.32 37.78,14.92 39.04,14.92 | JP2.15 36.83,15.88
  Top 0.203: 39.04,14.92 U$1.68
  Top 0.305: 36.83,15.88 37.39,15.32
P2.6
  Top 0.152: 38.37,14.61 35.56,14.61 34.29,15.88 JP2.14
  Top 0.178: 38.37,14.61 U$1.1
  Top 0.305: 34.29,15.88 34.37,15.88 34.85,15.4
P2.7
  Top 0.152: 38.12,14.29 35.24,14.29 34.29,15.24 32.07,15.24 | JP2.13 31.75,16.19
  Top 0.178: 38.12,14.29 U$1.2
  Top 0.305: 31.75,16.19 31.75,15.56 32.07,15.24
P3.0
  Top 0.152: 37.07,3.81 34.61,3.81 34.29,3.49 32.7,3.49 32.38,3.17 30.48,3.17 30.16,2.86 28.26,2.86 27.94,2.54 25.72,2.54 25.24,2.06 | 24.69,1.51 24.45,1.27 JP1.10
  Top 0.178: 37.07,3.81 U$1.29
  Top 0.305: 24.69,1.51 25.24,2.06
P3.1
  Top 0.152: 37.32,3.49 34.92,3.49 34.61,3.17 33.02,3.17 32.7,2.86 30.8,2.86 30.48,2.54 28.57,2.54 27.86,1.83 | JP1.11 27.3,1.27
  Top 0.178: 37.32,3.49 U$1.30
  Top 0.305: 27.3,1.27 27.86,1.83
P3.2
  Top 0.152: 37.57,3.17 35.24,3.17 34.92,2.86 33.34,2.86 33.02,2.54 31.11,2.54 30.32,1.75 | JP1.12 29.84,1.27
  Top 0.178: 37.57,3.17 U$1.31
  Top 0.305: 29.84,1.27 30.32,1.75
P3.3
  Top 0.152: 37.82,2.86 35.56,2.86 35.24,2.54 33.66,2.54 33.02,1.91 33.02,1.59 32.94,1.51 | JP1.13 32.38,1.27
  Top 0.178: 37.82,2.86 U$1.32
  Top 0.305: 32.38,1.27 32.7,1.27 32.94,1.51
P3.4
  Top 0.152: 38.06,2.54 35.88,2.54 35.56,2.22 35.56,1.59 35.24,1.27 34.85,1.27 JP1.14
  Top 0.203: 38.06,2.54 U$1.33
  Top 0.305: 34.85,1.27 35.16,1.27 35.48,1.59
P3.5
  Top 0.152: JP1.15 37.31,1.27 37.36,1.27
  Top 0.203: 37.36,1.27 U$1.34
  Top 0.305: 37.31,1.27 37.39,1.27 38.1,1.98
P3.6
  Top 0.152: 40.96,2.06 41.59,2.7 41.59,2.89 | 40.96,2.06 40.8,1.91 40.32,1.91 39.93,1.98 39.77,1.98 39.69,1.91 39.37,1.59 JP1.16 | 40.96,2.06
  Top 0.203: 41.59,2.89 U$1.36
  Top 0.305: 39.69,1.91 40.32,1.91
P3.7
  Top 0.152: 42.23,1.91 42.23,1.27 JP1.17 | 42.23,2.46 42.23,2.82
  Top 0.203: 42.23,2.82 U$1.37
  Top 0.305: 42.23,1.91 42.23,2.46
RESET  (via drill 0.3)
  Top 0.152: JP1.9 21.99,1.67 22.54,2.22 23.18,2.22 23.5,2.54 25.08,2.54 25.4,2.86 27.62,2.86 27.94,3.17 29.84,3.17 30.16,3.49 31.75,3.49 32.86,4.6 v32.86,5 | 34.75,7.14 34.67,7.06 33.89,7.06 33.34,7.62 v32.94,7.62
  Top 0.203: U$1.19 34.75,7.14
  Top 0.305: 21.99,1.67 22.07,1.67 22.54,2.14
  Route2 0.152: v32.94,7.62 32.86,7.62 v32.86,5
SCL  (via drill 0.3)
  Top 0.152: 14.45,4.76 v14.37,4.76 13.43,4.76 R11.2
  Top 0.203: IC1.15 16.14,4.32 15.95,4.13 15,4.13 v14.37,4.76
  Bottom 0.152: v14.37,4.76 12.7,4.76 12.38,5.08 11.23,5.08 IC2.1
SDA  (via drill 0.3)
  Top 0.152: R10.2 10.56,4.59 10.56,3.89 11.07,3.37 13.22,3.37 v13.65,3.81 13.73,3.73 16.43,3.73 16.63,3.93 16.63,4.88
  Top 0.203: 16.63,4.88 IC1.16
  Bottom 0.152: IC2.3 11.27,3.33 13.18,3.33 13.41,3.57 v13.65,3.81
SWDCK  (via drill 0.3)
  Top 0.152: 21.13,13.67 21.67,14.21 21.67,14.53 22.07,14.92 24.45,14.92 25.56,13.81 25.8,13.81 v27.07,12.54 | v32.07,11.75 35,11.75
  Top 0.178: 21.13,13.51 21.13,13.67
  Top 0.203: IC1.46 21.13,13.51 | 35,11.75 U$1.12
  Bottom 0.152: v27.07,12.54 27.07,10.72 27.46,10.32 27.78,10.32 28.57,9.53 31.43,9.53 32.07,10.16 v32.07,11.75
SWDIO  (via drill 0.3)
  Top 0.152: 21.63,13.69 21.99,14.05 21.99,14.29 22.3,14.61 24.13,14.61 v25.56,13.18 | 34.93,12.38 31.27,12.38 30.16,13.49 v29.53,13.49
  Top 0.178: 21.63,13.45 21.63,13.69
  Top 0.203: IC1.45 21.63,13.45 | 34.93,12.38 U$1.11
  Bottom 0.152: v25.56,13.18 26.11,13.18 26.67,13.73 29.29,13.73 v29.53,13.49
SWV
  Top 0.152: 20.64,13.65 21.27,14.29 21.27,14.92 21.59,15.24 22.3,15.24 24.61,15.24 25.56,14.29 27.78,14.29 29.37,12.7 29.37,12.05 29.4,12.02 30.85,12.02 31.75,11.11 34.51,11.11
  Top 0.178: 20.63,13.56 20.64,13.65
  Top 0.203: IC1.47 20.63,13.56 | 34.51,11.11 U$1.14
VBUS  (via drill 0.61)
  Top 0.406: v10.16,9.53 10.16,10 9.68,10.48 7.91,10.48 USB-MINIB.VBUS
  Bottom 0.152: 9.56,12.35 8.61,12.35 8.57,12.38 C29.2 | 10.24,9.53 v10.16,9.53 | R6.2 3.65,8.1 4.29,8.1 4.45,8.26 4.45,9.68 4.84,10.08 6.03,10.08 6.92,10.96 U$3.3
  Bottom 0.406: U$3.3 9.56,12.35 10.16,11.75 v10.16,9.53 | 7.58,14.32 U$3.1 7.9,14.32 8.57,13.65 C29.2
VCC  (via drill 0.3, 0.41)
  Top 0.152: v14.29,6.35 13.97,6.03 13.41,6.03 | 13.41,6.03 13.34,6.03 | R10.1 11.83,4.75 11.83,5.71 12.16,6.05 13.02,6.03 13.1,6.11 R11.1 13.41,6.05 13.41,6.03 | R8.2 24.8,8 v24.4,7.6
  Top 0.203: v23.65,13.65 22.7,13.65 22.62,13.57 22.62,12.86 22.64,12.86
  Top 0.305: IC1.32 23.95,7.32 v24.4,7.6 | 22.64,12.86 IC1.43 | IC1.17 17.13,4.11 v17.3,3.81 | IC1.13 14.32,6.32 v14.29,6.35 | IC1.11 14.62,7.32 v14.29,7.3 | IC1.3 14.4,11.32 v14.13,11.43 | IC1.55 16.63,13.85 v16.67,13.97 | IC1.7 14.73,9.32 14.37,9.68 v13.97,9.68 | IC1.27 22.13,4.22 22.23,4.13 23.65,4.13 v24.45,4.92
  Bottom 0.203: IC2.5 9.59,5.14 9.84,5.4 9.84,5.48 10.16,5.79 13.73,5.79 v14.29,6.35
  Bottom 0.305: v17.3,3.81 16.83,4.13 16.83,5.25 C22.1 | C25.1 16.91,13.73 v16.67,13.97 | C3.1 14.19,10.89 14.13,10.95 v14.13,11.43 14.13,11.99 14.26,12.12 C2.1 | C21.1 14.4,9.64 v13.97,9.68 | C26.1 14.63,7.64 v14.29,7.3 | C23.1 23.98,5.39 v24.45,4.92 | v23.65,13.65 22.24,13.65 C27.1 | R9.1 25.6,7.9 25.32,7.62 24.41,7.62 v24.4,7.6 24.19,7.79 C24.1 | C16.1 11.88,6.91 12.38,6.91
  Bottom 0.406: D1.1 1.03,9.48 1.03,6.03 1.43,5.64 6.19,5.64 7.46,6.91 12.38,6.91 12.54,6.91 13.02,7.38 13.02,9.6 v12.78,9.84
  pour Route15 (rank 2): 0,17.78 33.02,17.78 33.02,11.75 31.75,10.48 28.57,10.48 27.62,9.53 27.62,0 0,0
VCCD  (via drill 0.3)
  Top 0.152: v45.24,11.59 44.85,11.59
  Top 0.203: 44.85,11.59 U$1.57 | U$1.26 36.64,5.08 v36.2,5.08
  Bottom 0.203: 45.07,11.59 v45.24,11.59 | v36.2,5.08 | v36.2,5.08 37.94,6.83 37.94,7.62 39.53,9.21 40.4,9.21 40.8,8.81 41.59,8.81 41.83,9.05 41.99,9.05 42.15,9.21 42.86,9.21 v45.24,11.59 | v45.24,11.59
  Bottom 0.305: C14.1 45.96,10.87 v45.24,11.59
VDD  (via drill 0.3)
  Top 0.152: 40.64,3.28 U$1.35
  Top 0.203: 40.64,3.28 40.96,2.96 40.96,2.78 40.88,2.7 v40.01,2.7 | 43.72,11.59 v44.05,11.67 43.8,11.67 U$1.59 | 43.61,5.4 v44.05,5.16 43.93,5.08 U$1.44 | U$1.17 34.29,9.63 v34.29,9.84 | U$1.24 36.23,5.79 35.56,5.79 | 35.56,5.79 v35.48,5.79 35.45,5.74 35.56,5.79 | U$1.52 45.62,9.53 46.2,9.53 v46.51,9.21 | U$1.67 41.59,13.99 v41.59,14.29
  Route2 0.406: JP2.1 1.27,15.24 1.59,14.92 4.92,14.92 5.08,15.08 20.59,15.08 24.08,11.59 28.26,11.59 28.89,10.95 v28.89,8.81
  Bottom 0.152: 43.16,6.05 C4.1
  Bottom 0.203: 39.96,2.86 40.01,2.86 v40.01,2.7 | v41.59,14.29 41.51,14.45 41.12,14.45 40.09,13.42 C11.1
  Bottom 0.305: 43.58,11.67 43.26,11.35 43.18,11.35 | 43.18,11.35 43.02,11.35 42.31,12.06 42.07,12.06 | 43.18,11.35 43.18,11.43 | C5.1 43.21,11.23 43.36,11.23 | 43.36,11.23 42.52,12.07 C13.1 | 43.36,11.23 43.8,11.67 v44.05,11.67 | C8.1 35.23,10.33 35.09,10.33 | C17.1 28.81,7.54 28.84,7.56 | 28.84,8.73 v28.89,8.81 | 46.51,9.29 v46.51,9.21 47.31,8.41 47.31,7.78 46.63,7.11 C10.1 | v35.48,5.79 35.48,6.52 C12.1 35.01,7.05 C7.1 | C15.1 | C15.1 v40.01,2.7
  Bottom 0.406: 43.58,11.67 v44.05,11.67 | C4.1 v44.05,5.16 44.13,5.56 44.13,6.54 C9.1 | v34.29,9.84 34.53,9.84 34.61,9.84 35.09,10.33 | D2.1 0.71,11.47 0.71,15.16 1.27,15.72 JP2.1 | 28.84,7.56 28.84,8.73
  pour Route15: 33.66,17.78 33.66,11.43 32.07,9.84 28.89,9.84 28.26,9.21 28.26,0.32 28.57,0 50.8,0 50.8,17.78
VOUT
  Bottom 0.406: U$3.5 2.88,14.32 C31.1 2.84,14.29 2.06,14.29 1.83,14.05 1.83,12.46 2.14,12.14 3.1,12.14 3.41,11.83 3.41,11.11 D2.2 D1.2

### Text on the board
Top: TM | freeSoC Mini Development Kit v1.0 | Released under the Creative Commons Attribution Share-Alike 3.0 License | http://creativecommons.org/licenses/by-sa/3.0 | Design by: Jon Moeller | http://freesoc.net/ | freeSoC is a trademark of moeller.io, LLC, and may only be used with permission
tNames: VDD | 0.0 | 0.1 | 0.2 | 0.3 | 0.4 | 0.5 | 0.6 | 0.7 | 1.6 | 15.4 | 15.5 | 2.7 | 2.6 | 2.5 | 2.4 | 2.3 | 2.2 | 2.1 | 2.0 | !EA | ALE | !PSEN | xtal | mini | 12.0 | 12.1 | 12.2 | 12.3 | 12.4 | 12.5 | 12.6 | 12.7 | RST | 1.7 | 3.0 | 3.1 | 3.2 | 3.3 | 3.4 | 3.5 | 3.7 | MXI | MXO | freeSoC | 3.6 | GND
bNames: www.freesoc.net